# Altium schematic sheet 31_STM32.SchDoc
size A4; SheetNumber: 7; SheetTotal: 11
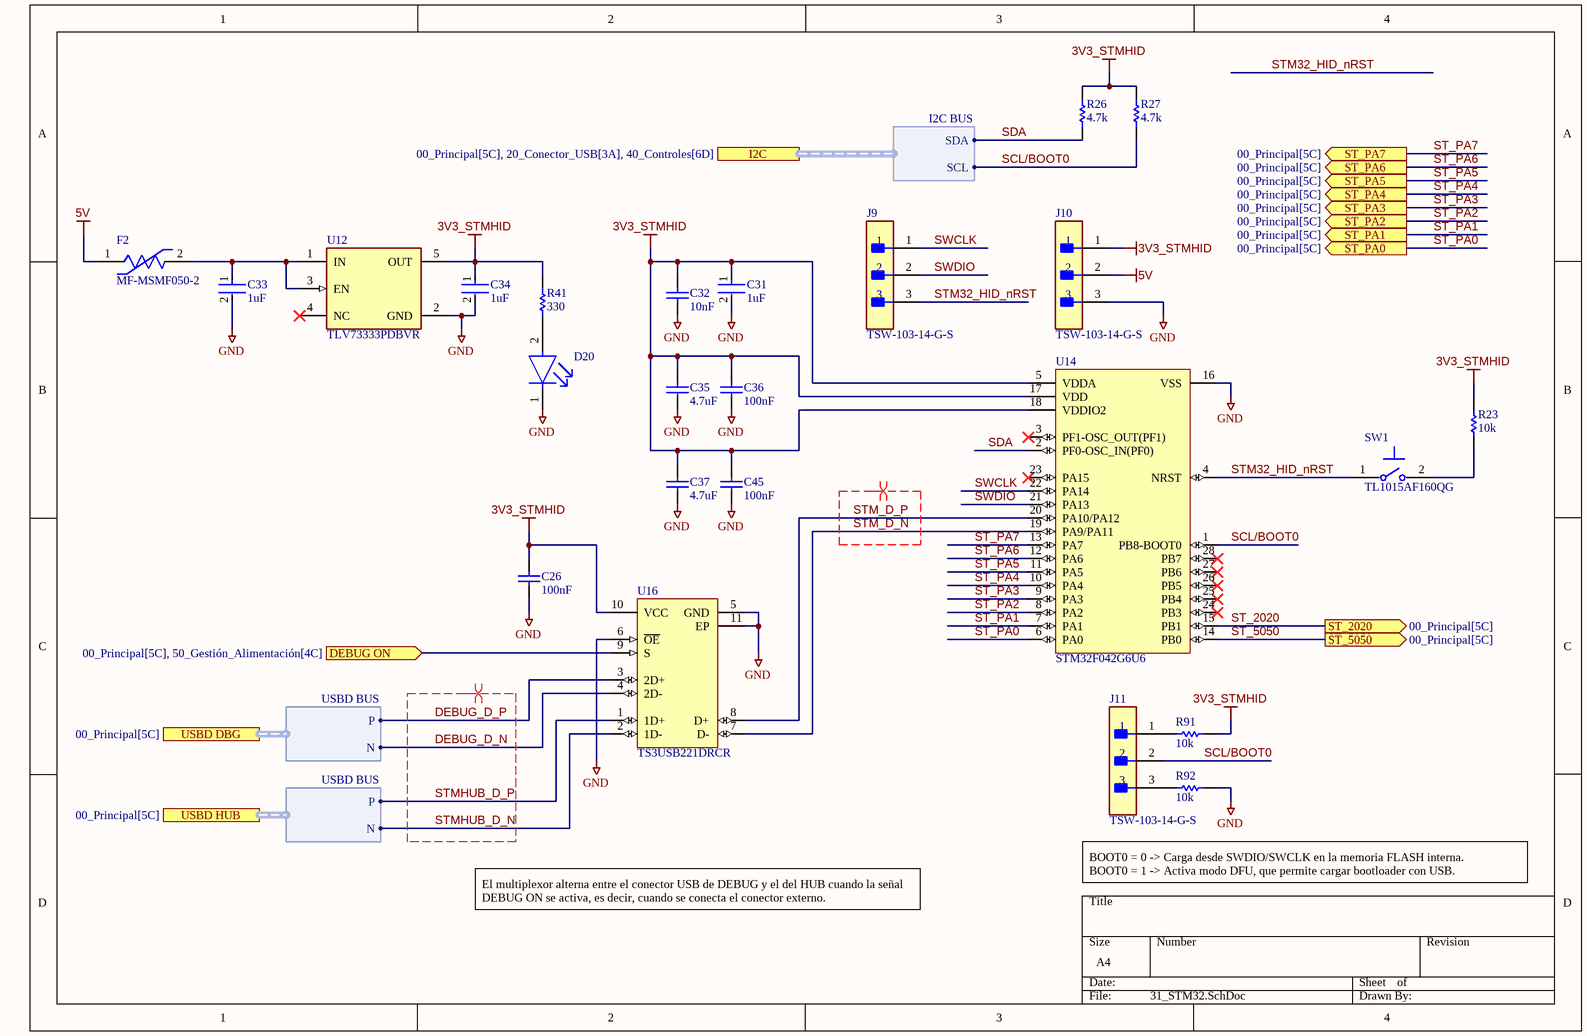
[diagram p0: 31_STM32.SchDoc]

## Parts
C26  100nF  [CAPC1005X55X25NL05T05]
C31  1uF  [FP-C0402C-BB-IPC_B]
C32  10nF  [CAPC1005X55X25ML05T05]
C33  1uF  [FP-C0402C-BB-IPC_B]
C34  1uF  [FP-C0402C-BB-IPC_B]
C35  4.7uF  [CAPC1005X71X25NL10T15]
C36  100nF  [CAPC1005X55X25NL05T05]
C37  4.7uF  [CAPC1005X71X25NL10T15]
C45  100nF  [CAPC1005X55X25NL05T05]
D20  APHD1608LZGCK  [FP-APHD1608LZGCK-MFG]  (value not drawn)
F2  MF-MSMF050-2  [FP-MF-MSMF050-2-MFG]
J9  TSW-103-14-G-S  [FP-TSW-103-14-G-S-MFG]
J10  TSW-103-14-G-S  [FP-TSW-103-14-G-S-MFG]
J11  TSW-103-14-G-S  [FP-TSW-103-14-G-S-MFG]
R23  10k  [RESC1005X40X25ML05T05]
R26  4.7k  [RESC1005X40X25ML05T10]
R27  4.7k  [RESC1005X40X25ML05T10]
R41  330  [RESC1005X40X25NL10T10]
R91  10k  [RESC1005X40X25ML05T05]
R92  10k  [RESC1005X40X25ML05T05]
SW1  TL1015AF160QG  [FP-TL1015AF160QG-MFG]
U12  TLV73333PDBVR  [FP-DBV0005A-MFG]
U14  STM32F042G6U6  [STM-UFQFPN28_V]
U16  TS3USB221DRCR  [DRC0010J_V]

## Ports
DEBUG ON (in, see 00_Principal[5C], 50_Gestión_Alimentación[4C]), I2C (harness I2C BUS, see 00_Principal[5C], 20_Conector_USB[3A], 40_Controles[6D]), ST_2020 (out, see 00_Principal[5C]), ST_5050 (out, see 00_Principal[5C]), ST_PA0 (out, see 00_Principal[5C]), ST_PA1 (out, see 00_Principal[5C]), ST_PA2 (out, see 00_Principal[5C]), ST_PA3 (out, see 00_Principal[5C]), ST_PA4 (out, see 00_Principal[5C]), ST_PA5 (out, see 00_Principal[5C]), ST_PA6 (out, see 00_Principal[5C]), ST_PA7 (out, see 00_Principal[5C]), USBD DBG (harness USBD BUS, see 00_Principal[5C]), USBD HUB (harness USBD BUS, see 00_Principal[5C])

## Harnesses
USBD BUS: P, N
I2C BUS: SDA, SCL

## Nets
3V3_STMHID: C26.2 C31.1 C32.2 C34.1 C35.2 C36.2 C37.2 C45.2 J10.1 R23.2 R26.2 R27.2 R41.2 R91.1 U12.5(OUT) U14.5(VDDA) U14.17(VDD) U14.18(VDDIO2) U16.10(VCC)
5V: F2.1 J10.2
GND: C26.1 C31.2 C32.1 C33.2 C34.2 C35.1 C36.1 C37.1 C45.1 D20.1(C) J10.3 R92.1 U12.2(GND) U14.16(VSS) U16.5(GND) U16.6(~{OE}) U16.11(EP)
DEBUG ON: U16.9(S) ; port DEBUG ON
DEBUG_D_N: U16.4(2D-)
DEBUG_D_P: U16.3(2D+) ; port USBD DBG.P
SCL/BOOT0: J11.2 R27.1 U14.1(PB8-BOOT0) ; port I2C.SCL
SDA: R26.1 U14.2(PF0-OSC_IN(PF0)) ; port I2C.SDA
ST_2020: U14.15(PB1) ; port ST_2020
ST_5050: U14.14(PB0) ; port ST_5050
ST_PA0: U14.6(PA0) ; port ST_PA0
ST_PA1: U14.7(PA1) ; port ST_PA1
ST_PA2: U14.8(PA2) ; port ST_PA2
ST_PA3: U14.9(PA3) ; port ST_PA3
ST_PA4: U14.10(PA4) ; port ST_PA4
ST_PA5: U14.11(PA5) ; port ST_PA5
ST_PA6: U14.12(PA6) ; port ST_PA6
ST_PA7: U14.13(PA7) ; port ST_PA7
STM32_HID_nRST: J9.3 SW1.1 U14.4(NRST)
STM_D_N: U14.19(PA9/PA11) U16.7(D-)
STM_D_P: U14.20(PA10/PA12) U16.8(D+)
STMHUB_D_N: U16.2(1D-)
STMHUB_D_P: U16.1(1D+) ; port USBD HUB.P
SWCLK: J9.1 U14.22(PA14)
SWDIO: J9.2 U14.21(PA13)
NetC33_1: C33.1 F2.2 U12.1(IN) U12.3(EN)
NetD20_2: D20.2(A) R41.1
NetJ11_1: J11.1 R91.2
NetJ11_3: J11.3 R92.2
NetR23_1: R23.1 SW1.2

Not connected (* = marked no-connect by the designer): U12 4(NC)*; U14 3(PF1-OSC_OUT(PF1))* 23(PA15)* 24(PB3)* 25(PB4)* 26(PB5)* 27(PB6)* 28(PB7)*

## Layout directives
differential pair; rule Differential Pairs Routing [Pref Gap = 5mil    Min Gap  = 5mil    Max Gap  = 5milPref Width = 8.655mil    Min Width  = 8.655mil    Max Width  = 8.655mil]: DEBUG_D_N, DEBUG_D_P, STM_D_N, STM_D_P, STMHUB_D_N, STMHUB_D_P

## Notes on the sheet
- El multiplexor alterna entre el conector USB de DEBUG y el del HUB cuando la señal DEBUG ON se activa, es decir, cuando se conecta el conector externo.
- BOOT0 = 0 -> Carga desde SWDIO/SWCLK en la memoria FLASH interna.
  BOOT0 = 1 -> Activa modo DFU, que permite cargar bootloader con USB.

## Library data of the parts
C26 C36 C45 = CMP-2008-02030-1: Manufacturer: Vitramon; Part Number: VJ0402Y104KXJCW1BC
C31 C33 C34 = CMP-03020-034679-1: CAP CER 1UF 16V X5R 0402; Dielectric Material: Ceramic; Tolerance: 10%; RoHS Compliant: Yes; Voltage Rating (DC): 16V; Voltage Rating: 16V; Max Operating Temperature: 85°C; Packaging: Cut Tape; Width: 0.02inch; Dielectric: X5R; Lead Free: Lead Free; Min Operating Temperature: -55°C; Mount: Surface Mount; Case/Package: 0402; Thickness: 0.022inch; REACH SVHC: No SVHC; Length: 0.039inch; Case Code (Metric): 1005; Case Code (Imperial): 0402; Capacitance: 1uF
C32 = CMP-2008-02027-1: Part Number: VJ0402Y103KXJCW1BC; Manufacturer: Vitramon
C35 C37 = CMP-2008-02043-1: Part Number: 0402ZD475MAT2A; Manufacturer: AVX Interconnect / Elco
D20 = CMP-44529-000045-1: LED GREEN CLEAR 1608 SMD; Test Current: 2mA; Dominant Wavelength: 525nm; Lens Color: Colorless; Luminous Intensity: 180mcd; Viewing Angle: 100°; Forward Voltage: 2.65V; Lens Size: 0.7mm; Lens Style: Round; Mount: Surface Mount; Packaging: Tape and Reel; Lens Transparency: Clear; Height: 0.75mm; Case/Package: 0603; Length: 1.6mm; Case Code (Metric): 1608; Width: 0.8mm; Color: Green; Case Code (Imperial): 0603
F2 = CMP-2100-03653-2: PTC RESET FUSE 15V 500MA 1812; Manufacturer: Bourns; Value: 0.15-1Ω; Trip Current: 1A; Automotive Grade: Grade 3; Trip Time: 0.15s; Current Rating: 100A; Hold Current: 0.5A; Height: 0.85mm; Package: 1812; Voltage Rating: 15V; Temperature Range High: +85°C; Device Class L2: PTC Resettable Fuses; Lead Free: Yes; ComponentLink2URL: http://www.bourns.com/docs/Product-Datasheets/mfmsmf.pdf; Ambient Temperature Range High: +85°C; Mouser Description: PTC Resettable Fuse 0.5A(hold) 1A(trip) 15V 100A 0.8W 0.15s 0.15Ohm SMD Solder Pad 1812 T/R; Digikey Description: PTC RESET FUSE 15V 500MA 1812; Manufacturer Part Number: MF-MSMF050-2; Resistance: 0.15-1Ω; Category: Fuse; ComponentLink2Description: Datasheet; Automotive: Yes; Temperature Range Low: -40°C; RoHS: TRUE; Device Class L1: Circuit Protection; Temperature: -40°C to +85°C; Octopart: https://octopart.com/mf-msmf050-2-bourns-28047; Ambient Temperature Range Low: -40°C; Device Class L3: unset
J9-J11 = CMP-02766-001743-1: CONN HEADER VERT 3POS 2.54MM; Max Voltage Rating (AC): 550V; Number of Positions: 3; Max Current Rating: 7.6A; Gender: Male; Termination: Solder; RoHS Compliant: Yes; Mount: Through Hole; Lead Free: Lead Free; Connector Type: Header; REACH SVHC: No SVHC; Insulation Color: Black; Width: 2.54mm; Length: 7.62mm; Flammability Rating: UL94 V-0; Housing Material: Polyester; Contact Material: Bronze; Max Operating Temperature: 125°C; Fastening Type: Pull; Series: TSW; Number of Contacts: 3; Packaging: Bulk; Min Operating Temperature: -55°C; Package Quantity: 1; Height: 10.67mm; Pitch: 2.54mm; Contact Finish - Mating: GOLD; Contact Type: Male Pin; Radiation Hardening: No; Color: Black; Housing Color: Black; Contact Plating: Gold; Orientation: Straight; Number of Rows: 1; Depth: 2.54mm; Insulation Material: PBT; Contact Mating Length: 0.32inch; Contact Shape: Square
R23 R91 R92 = CMP-2002-00601-1: Manufacturer: Panasonic; Part Number: ERJ-2RHD1002X
R26 R27 = CMP-2002-06456-1: Manufacturer: Panasonic; Part Number: ERJ-S02F4701X
R41 = CMP-2002-05883-1: Manufacturer: Panasonic; Part Number: ERA2AEB331X
SW1 = CMP-17879-000003-1: SWITCH TACTILE SPST-NO 0.05A 12V; Actuator Type: Standard; Actuator Length: 0.5mm; Contact Current Rating: 50mA; Mechanical Life: 200000Cycles; Switch Function: Off-Mom; Switch Travel: 0.2mm; Illumination Type: Non-Illuminated; Operating Force: 160gf; Actuator Material: Nylon; Electrical Life: 50000Cycles; Throw Configuration: SPST; Contact Resistance: 100mR; Orientation: Straight; Max Voltage Rating (DC): 12V; Max Operating Temperature: 70°C; Package Quantity: 1; Contact Material: Silver; Packaging: Tape and Reel; Mount: Surface Mount; Color: Beige; Termination: Gull Wing; Case/Package: SMD/SMT; Voltage Rating (DC): 12V; Contact Plating: Silver; REACH SVHC: No SVHC; Min Operating Temperature: -20°C; Current Rating: 50mA; Lead Free: Lead Free
U12 = CMP-04917-000053-1: IC REG LINEAR 3.3V 300MA SOT23-5; Manufacturer: Texas Instruments; Max Junction Temp: +125°C; Accuracy Percentage: 1%; Min Supply Voltage: 1.4V; Number Of Outputs: 1; Dropout Voltage: 125mV; Nominal Supply Current: 34uA; Max Supply Voltage: 5.5V; Output Type: Fixed; Standoff Height: 0mm; Digikey Description: IC REG LINEAR 3.3V 300MA SOT23-5; Manufacturer Part Number: TLV73333PDBVR; Temperature Range High: +125°C; Temperature: -40°C to +125°C; Output Current: 300mA; Mouser Description: LDO Voltage Regulators Capacitr-Free 300-mA 5-SOT-23 -40 to 125; Automotive: No; Height: 1.45mm; Device Class L3: Voltage Regulators - Linear; ComponentLink2Description: Datasheet; Device Class L1: Integrated Circuits (ICs); ComponentLink2URL: http://www.ti.com/lit/ds/symlink/tlv733p.pdf; Octopart: https://octopart.com/tlv73333pdbvr-texas+instruments-51080890; Temperature Range Low: -40°C; RoHS: TRUE; Lead Free: Yes; Output Voltage: 3.3V; Package: DBV0005A; Device Class L2: Power Management ICs; Category: IC
U14 = CMP-0304-00112-2: ARM Cortex-M0 32-bit MCU, 32 KB Flash, 6 KB Internal RAM, 24 I/Os, 28-Pin UFQFPN, -40 to 85 degC, Tray; Manufacturer: STMicroelectronics; FLASH Size (Prog) (kB): 32; I/Os (High Current): 24; Internal RAM Size (kB): 6; Supply Voltage(Vcc) min (V): 2; Operating Frequency(F) (Processor speed) (MHz): 48; Core: ARM Cortex-M0; PartNumber: STM32F042G6U6; Packing: Tray; Package Description: 28-Pin Ultra Thin Fine Pitch Quad Flat No-Lead, 4 x 4 x 0.6 mm Body, 0.5 mm Pitch; ComponentLink2Description: Datasheet; ComponentLink1Description: Manufacturer URL; Package Reference: UFQFPN28; DatasheetVersion: Rev. 5; ComponentLink1URL: http://www.st.com/; ComponentLink2URL: http://www.st.com/st-web-ui/static/active/en/resource/technical/document/datasheet/DM00105814.pdf; Mounting Technology: Surface Mount
U16 = CMP-0309-00084-2: High-Speed USB 2.0 (480 Mbps) 1:2 Multiplexer / Demultiplexer Switch with Single Enable, 6 ohm RON, 2.5 to 3.3V, -40 to 85 degC, 10-Pin SON (DRC), Green (RoHS & no Sb/Br); Manufacturer: Texas Instruments; Number of Channels: 2; ON Time(Max)(ns): 30; SubFamily: USB Switch; RON Mis-match(Max)(Ohms): 0.2; Vcc range(V): 2.3 to 3.6; tpd max(ns): 0.25; OFF Time(Max)(ns): 12; ron(max)(ohms): 6; ESD HBM(kV): +/-2; Architecture: "1","2 mux/demux"; RON Flatness(Max)(Ohms): 1; Bandwidth(MHz): 1200; IL OFF(Max)(nA): 2; PackageVersion: revL, Sep-2011; Mounting Technology: Surface Mount; ICC(uA): 30; DatasheetVersion: SCDS220G; PartNumber: TS3USB221DRCR; Charge Injection(Max)(pC): N/A; ComponentLink1Description: Datasheet; PackageDescription: 10-Pin Plastic Small Outline No-Lead, 3 x 3 x 1 mm Body, 0.5 mm Pitch, Exposed Pad; ComponentLink2URL: http://www.ti.com/litv/pdf/mpds117k; Eco-Plan: Green (RoHS & no Sb/Br); ComponentLink2Description: Package Specification; ComponentLink1URL: http://www.ti.com/general/docs/lit/getliterature.tsp?genericPartNumber=TS3USB221&fileType=pdf; PackageReference: DRC0010J